# EAGLE design Extern_Kernal_REX9628 (EAGLE 9.2.2)
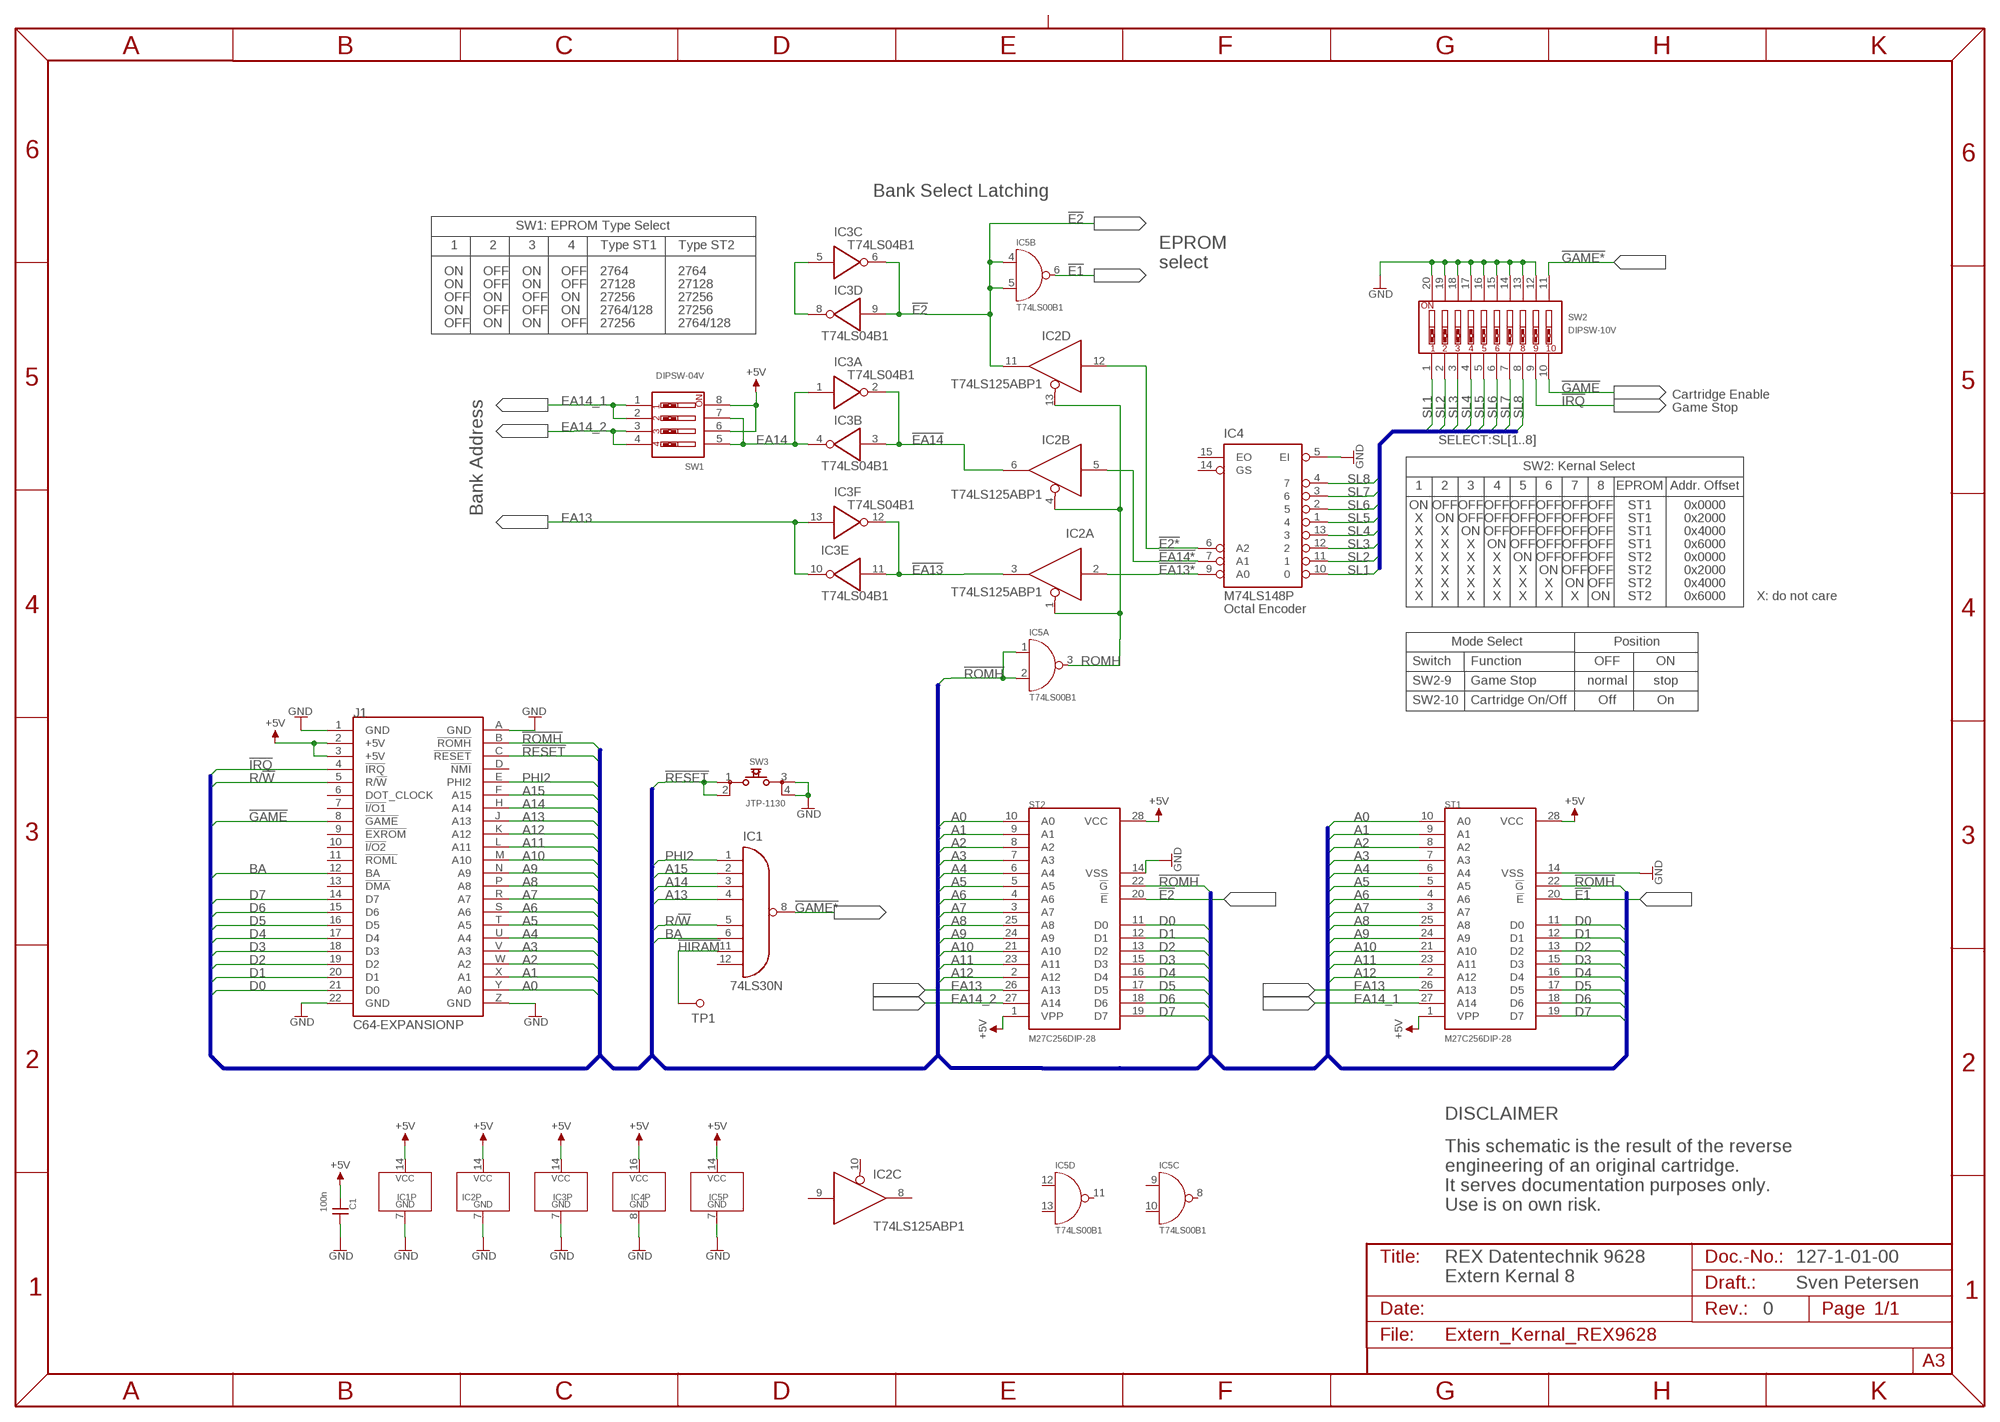
[diagram p0: schematic, sheet 1]

## Parts
C1  100n  CAP01  [C-2,5]
IC1  74LS30N  7430DIP  [DIL-14]
IC2  T74LS125ABP1  74125DIP  [DIL-14]
IC3  T74LS04B1  7404DIL  [DIL-14]
IC4  M74LS148P  74148DIL  [DIL-16]
IC5  T74LS00B1  7400DIP  [DIL-14]
J1  C64-EXPANSIONP  [EXPPORT]
ST1  M27C256DIP-28  [DIL28-6]
ST2  M27C256DIP-28  [DIL28-6]
SW1  DIPSW-04V  [DIPSW-04V]
SW2  DIPSW-10V  [DIPSW-10V]
SW3  JTP-1130  [JTP-1130]
TP1  1,3/2,0  [1,3/2,0]

## Nets
!E1: IC5.6(B:O) ST1.20(!E)
!E2: IC2.11(D:O) IC3.6(C:O) IC3.9(D:I) IC5.4(B:I0) IC5.5(B:I1) ST2.20(!E)
!E2*: IC2.12(D:I) IC4.6(A2)
!EA13: IC2.3(A:O) IC3.11(E:I) IC3.12(F:O)
!EA13*: IC2.2(A:I) IC4.9(A0)
!EA14: IC2.6(B:O) IC3.2(A:O) IC3.3(B:I)
!EA14*: IC2.5(B:I) IC4.7(A1)
!GAME: J1.8(!GAME) SW2.10
!GAME*: IC1.8(O) SW2.11
!HIRAM: IC1.11(I6) TP1.1
!IRQ: J1.4(!IRQ) SW2.9
!RESET: J1.C(!RESET) SW3.1 SW3.2
!ROMH: IC5.1(A:I0) IC5.2(A:I1) J1.B(!ROMH) ST1.22(!G) ST2.22(!G)
+5V: C1.1 IC1.14(VCC) IC2.14(P:VCC) IC3.14(P:VCC) IC4.16(VCC) IC5.14(P:VCC) J1.2(+5V) J1.3(+5V) ST1.1(VPP) ST1.28(VCC) ST2.1(VPP) ST2.28(VCC) SW1.6 SW1.8
A0: J1.Y(A0) ST1.10(A0) ST2.10(A0)
A1: J1.X(A1) ST1.9(A1) ST2.9(A1)
A2: J1.W(A2) ST1.8(A2) ST2.8(A2)
A3: J1.V(A3) ST1.7(A3) ST2.7(A3)
A4: J1.U(A4) ST1.6(A4) ST2.6(A4)
A5: J1.T(A5) ST1.5(A5) ST2.5(A5)
A6: J1.S(A6) ST1.4(A6) ST2.4(A6)
A7: J1.R(A7) ST1.3(A7) ST2.3(A7)
A8: J1.P(A8) ST1.25(A8) ST2.25(A8)
A9: J1.N(A9) ST1.24(A9) ST2.24(A9)
A10: J1.M(A10) ST1.21(A10) ST2.21(A10)
A11: J1.L(A11) ST1.23(A11) ST2.23(A11)
A12: J1.K(A12) ST1.2(A12) ST2.2(A12)
A13: IC1.4(I3) J1.J(A13)
A14: IC1.3(I2) J1.H(A14)
A15: IC1.2(I1) J1.F(A15)
BA: IC1.6(I5) J1.12(BA)
D0: J1.21(D0) ST1.11(D0) ST2.11(D0)
D1: J1.20(D1) ST1.12(D1) ST2.12(D1)
D2: J1.19(D2) ST1.13(D2) ST2.13(D2)
D3: J1.18(D3) ST1.15(D3) ST2.15(D3)
D4: J1.17(D4) ST1.16(D4) ST2.16(D4)
D5: J1.16(D5) ST1.17(D5) ST2.17(D5)
D6: J1.15(D6) ST1.18(D6) ST2.18(D6)
D7: J1.14(D7) ST1.19(D7) ST2.19(D7)
EA13: IC3.10(E:O) IC3.13(F:I) ST1.26(A13) ST2.26(A13)
EA14: IC3.1(A:I) IC3.4(B:O) SW1.5 SW1.7
EA14_1: ST1.27(A14) SW1.1 SW1.2
EA14_2: ST2.27(A14) SW1.3 SW1.4
GND: C1.2 IC1.7(GND) IC2.7(P:GND) IC3.7(P:GND) IC4.5(EI) IC4.8(GND) IC5.7(P:GND) J1.1(GND) J1.22(GND) J1.A(GND) J1.Z(GND) ST1.14(VSS) ST2.14(VSS) SW2.12 SW2.13 SW2.14 SW2.15 SW2.16 SW2.17 SW2.18 SW2.19 SW2.20 SW3.3 SW3.4
N$3: IC3.5(C:I) IC3.8(D:O)
PHI2: IC1.1(I0) J1.E(PHI2)
R/!W: IC1.5(I4) J1.5(R/!W)
ROMH: IC2.1(A:OE) IC2.4(B:OE) IC2.13(D:OE) IC5.3(A:O)
SL1: IC4.10 SW2.1
SL2: IC4.11 SW2.2
SL3: IC4.12 SW2.3
SL4: IC4.13 SW2.4
SL5: IC4.1 SW2.5
SL6: IC4.2 SW2.6
SL7: IC4.3 SW2.7
SL8: IC4.4 SW2.8
Unconnected: IC1.12(I7) IC2.8(C:O) IC2.9(C:I) IC2.10(C:OE) IC4.14(GS) IC4.15(EO) IC5.8(C:O) IC5.9(C:I0) IC5.10(C:I1) IC5.11(D:O) IC5.12(D:I0) IC5.13(D:I1) J1.6(DOT_CLOCK) J1.7(!I/O1) J1.9(!EXROM) J1.10(!I/O2) J1.11(!ROML) J1.13(!DMA) J1.D(!NMI)

## Buses
EXPANSION:A0,A1,A2,A3,A4,A5,A6,A7,A8,A9,A10,A11,A12,A13,A14,A15,BA,D0,D1,D2,D3,D4,D5,D6,D7,!DMA,DOT_CLK,!EXROM,!GAME,!I/O1,!I/O2,!IRQ,!NMI,PHI2,!RESET,!ROMH,!ROML,R/!W
SELECT:SL[1..8]

## Notes on the sheet
- Bank Select Latching
- SW1: EPROM Type Select
- 1 | 2 | 3 | 4 | Type ST1 | Type ST2
- EPROM
  select
- ON | OFF | ON | OFF | 2764 | 2764
- ON | OFF | ON | OFF | 27128 | 27128
- OFF | ON | OFF | ON | 27256 | 27256
- ON | OFF | OFF | ON | 2764/128 | 27256
- OFF | ON | ON | OFF | 27256 | 2764/128
- Cartridge Enable
- Game Stop
- SW2: Kernal Select
- 1 | 2 | 3 | 4 | 5 | 6 | 7 | 8 | EPROM | Addr. Offset
- ON | OFF | OFF | OFF | OFF | OFF | OFF | OFF | ST1 | 0x0000
- Bank Address
- X | ON | OFF | OFF | OFF | OFF | OFF | OFF | ST1 | 0x2000
- X | X | ON | OFF | OFF | OFF | OFF | OFF | ST1 | 0x4000
- X | X | X | ON | OFF | OFF | OFF | OFF | ST1 | 0x6000
- X | X | X | X | ON | OFF | OFF | OFF | ST2 | 0x0000
- X | X | X | X | X | ON | OFF | OFF | ST2 | 0x2000
- X | X | X | X | X | X | ON | OFF | ST2 | 0x4000
- X | X | X | X | X | X | X | ON | ST2 | 0x6000 | X: do not care
- Octal Encoder
- Mode Select | Position
- Switch | Function | OFF | ON
- SW2-9 | Game Stop | normal | stop
- SW2-10 | Cartridge On/Off | Off | On
- DISCLAIMER
- This schematic is the result of the reverse
  engineering of an original cartridge.
  It serves documentation purposes only.
  Use is on own risk.
- REX Datentechnik 9628 | 127-1-01-00
- Extern Kernal 8
- Sven Petersen
- 0

## Library data of the parts
C1 = DISCRETE:CAP01
IC1 = 74XX:7430
IC2 = 74XX:74125
IC3 = 74XX:7404
IC4 = 74XX:74148
IC5 = 74XX:7400: Quad 2-input NAND Gate SO14
J1 = Commodore:C64-EXPANSIONP
ST1 ST2 = ST:M27C256
SW1 = DIPSWITCH:DIPSW-04
SW2 = DIPSWITCH:DIPSW-10
SW3 = Namae_Electronics:JTP-1130
TP1 = Pads:1,3/2,0: Testpunkt Typ: 13.70.635 Hersteller: Ettinger Technologie: Einpresstechnik Bauform: - erzeugt von: C. Zellner am: 13.3.2015 letzte Änderung: - Eagle-Version: 6.5.0

## Board
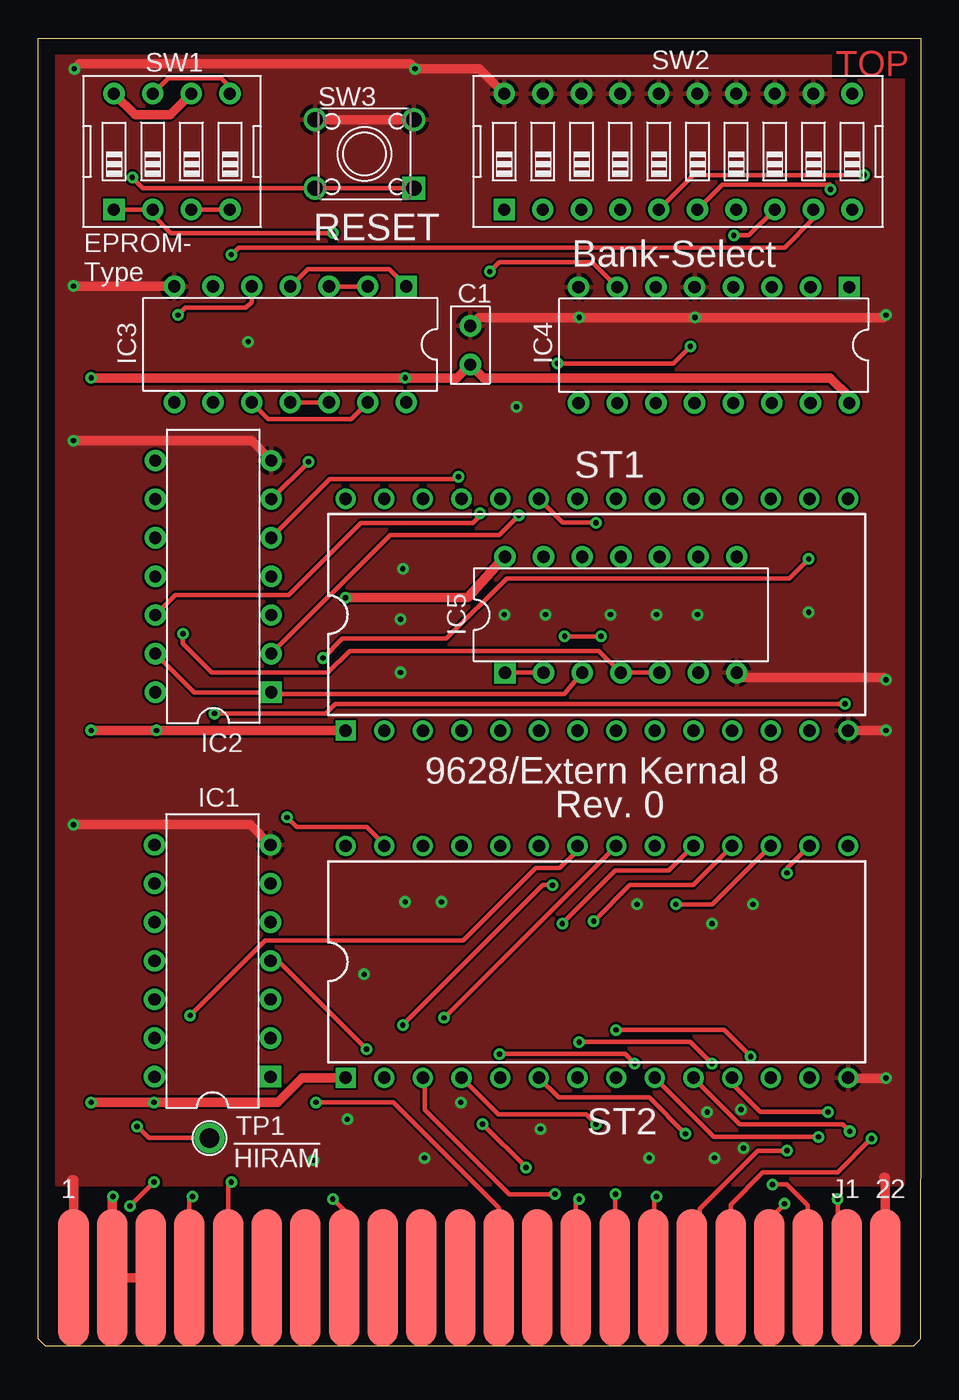
[diagram p1: board, top side]
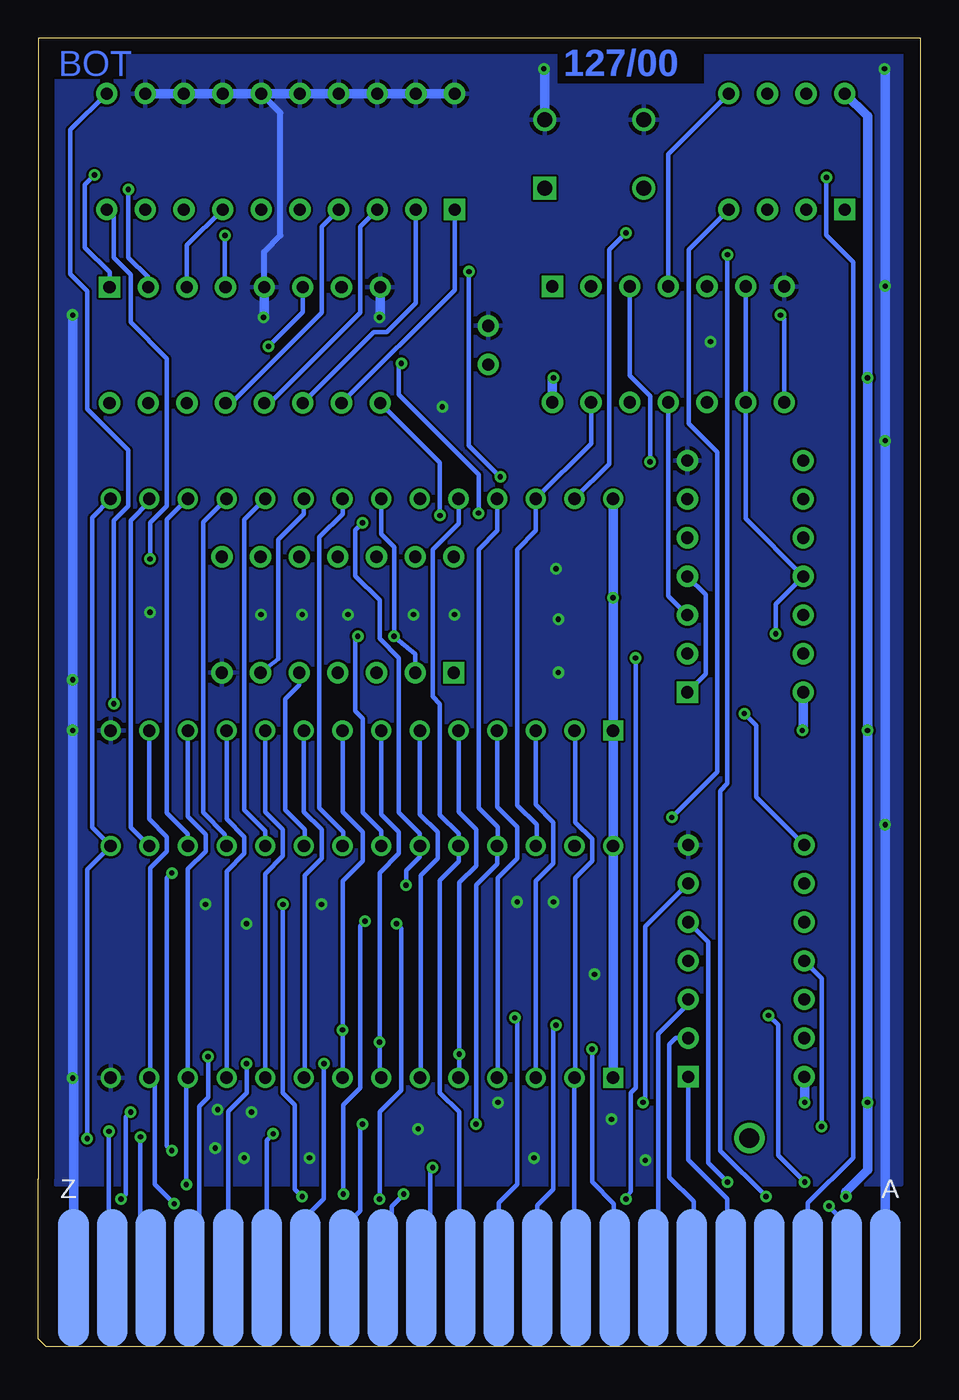
[diagram p2: board, bottom side, seen from below]

Size 58 x 86 mm. Coordinates in mm from the lower left corner, seen from the top.
Outline: 0,11 0,86 58,86 58,11
Copper layers (1*16): Top 0.035mm / dielectric 1.5mm / Bottom 0.035mm
Design rules "default *": minimum track width 6mil, minimum drill 0.35mm, track to track 6mil, track to pad 6mil, pad to pad 6mil, via to via 6mil, smd to smd 6mil, copper to edge 40mil, drill to drill 6mil, minimum pad ring 10mil, minimum via ring 8mil, stop-mask expansion 4mil, vias tented up to drill 25mil, thermal gap 10mil
bRestrict: 4 lines

### Footprints (pad centres in the part's own frame; a part is rotated, then mirrored left to right if it is on the bottom)
C-2,5 = drill 0.8 pad 1.397: 1 -1.27,0; 2 1.27,0
DIL-14 = drill 0.8 pad 1.397 square: 1 -7.62,-3.81 | drill 0.8 pad 1.397: 2 -5.08,-3.81; 3 -2.54,-3.81; 4 0,-3.81; 5 2.54,-3.81; 6 5.08,-3.81; 7 7.62,-3.81; 8 7.62,3.81; 9 5.08,3.81; 10 2.54,3.81; 11 0,3.81; 12 -2.54,3.81; 13 -5.08,3.81; 14 -7.62,3.81
DIL-16 = drill 0.8 pad 1.397 square: 1 -8.89,-3.81 | drill 0.8 pad 1.397: 2 -6.35,-3.81; 3 -3.81,-3.81; 4 -1.27,-3.81; 5 1.27,-3.81; 6 3.81,-3.81; 7 6.35,-3.81; 8 8.89,-3.81; 9 8.89,3.81; 10 6.35,3.81; 11 3.81,3.81; 12 1.27,3.81; 13 -1.27,3.81; 14 -3.81,3.81; 15 -6.35,3.81; 16 -8.89,3.81
EXPPORT = smd 2 x 9: 1 26.67,-4.5; 2 24.13,-4.5; 3 21.59,-4.5; 4 19.05,-4.5; 5 16.51,-4.5; 6 13.97,-4.5; 7 11.43,-4.5; 8 8.89,-4.5; 9 6.35,-4.5; 10 3.81,-4.5; 11 1.27,-4.5; 12 -1.27,-4.5; 13 -3.81,-4.5; 14 -6.35,-4.5; 15 -8.89,-4.5; 16 -11.43,-4.5; 17 -13.97,-4.5; 18 -16.51,-4.5; 19 -19.05,-4.5; 20 -21.59,-4.5; 21 -24.13,-4.5; 22 -26.67,-4.5 | smd 2 x 9 bottom: A 26.67,-4.5; B 24.13,-4.5; C 21.59,-4.5; D 19.05,-4.5; E 16.51,-4.5; F 13.97,-4.5; H 11.43,-4.5; J 8.89,-4.5; K 6.35,-4.5; L 3.81,-4.5; M 1.27,-4.5; N -1.27,-4.5; P -3.81,-4.5; R -6.35,-4.5; S -8.89,-4.5; T -11.43,-4.5; U -13.97,-4.5; V -16.51,-4.5; W -19.05,-4.5; X -21.59,-4.5; Y -24.13,-4.5; Z -26.67,-4.5
DIL28-6 = drill 0.813 square: 1 -16.51,-7.62 | drill 0.813: 2 -13.97,-7.62; 3 -11.43,-7.62; 4 -8.89,-7.62; 5 -6.35,-7.62; 6 -3.81,-7.62; 7 -1.27,-7.62; 8 1.27,-7.62; 9 3.81,-7.62; 10 6.35,-7.62; 11 8.89,-7.62; 12 11.43,-7.62; 13 13.97,-7.62; 14 16.51,-7.62; 15 16.51,7.62; 16 13.97,7.62; 17 11.43,7.62; 18 8.89,7.62; 19 6.35,7.62; 20 3.81,7.62; 21 1.27,7.62; 22 -1.27,7.62; 23 -3.81,7.62; 24 -6.35,7.62; 25 -8.89,7.62; 26 -11.43,7.62; 27 -13.97,7.62; 28 -16.51,7.62
DIPSW-04V = drill 0.787 pad 1.397 square: 1 -3.81,-3.81 | drill 0.787 pad 1.397: 2 -1.27,-3.81; 3 1.27,-3.81; 4 3.81,-3.81; 5 3.81,3.81; 6 1.27,3.81; 7 -1.27,3.81; 8 -3.81,3.81
DIPSW-10V = drill 0.787 pad 1.397 square: 1 -11.43,-3.81 | drill 0.787 pad 1.397: 2 -8.89,-3.81; 3 -6.35,-3.81; 4 -3.81,-3.81; 5 -1.27,-3.81; 6 1.27,-3.81; 7 3.81,-3.81; 8 6.35,-3.81; 9 8.89,-3.81; 10 11.43,-3.81; 11 11.43,3.81; 12 8.89,3.81; 13 6.35,3.81; 14 3.81,3.81; 15 1.27,3.81; 16 -1.27,3.81; 17 -3.81,3.81; 18 -6.35,3.81; 19 -8.89,3.81; 20 -11.43,3.81
JTP-1130 = drill 1 square: 1 3.25,-2.25 | drill 1: 2 -3.25,-2.25; 3 3.25,2.25; 4 -3.25,2.25
1,3/2,0 = drill 1.3 pad 2: 1 0,0

### Placement (x,y rotation side)
C1  28.41,65.81 90 top
IC1  11.46,25.34 90 top
IC2  11.52,50.61 90 top
IC3  16.58,65.86 180 top
IC4  44.41,65.82 180 top
IC5  38.3,48.09 0 top
J1  29,0 180 top
ST1  36.72,48.09 0 top
ST2  36.72,25.27 0 top
SW1  8.8,78.54 0 top
SW2  42.06,78.54 0 top
SW3  21.45,78.38 0 top
TP1  11.26,13.69 0 top
U$44  [2LAYER]  52.39,83.5 0 top
U$45  [PCB-TITLE/]  0,93.98 0 top  (outside the outline)

### Tracks (layer width: path | path; a pad name or v marks a point on that pad's centre or on a via)
!E1
  Bottom 0.305: ST1.20 40.53,54.72 42.23,53.02 42.23,45.18 IC5.6
!E2  (via drill 0.35)
  Top 0.305: IC5.5 IC5.4 36.86,45.72 20.48,45.72 19.05,44.29 11.43,44.29 9.53,46.2 v9.53,46.83
  Bottom 0.305: IC5.5 40.84,43.46 41.75,42.55 41.75,35.24 40.48,33.97 40.48,32.94 ST2.20 | v9.53,46.83 9.53,48.8 IC2.11 11.5,54.4 IC3.9 IC3.6
!E2*  (via drill 0.35)
  Top 0.305: IC2.12 9.01,49.37 16.46,49.37 21.2,54.12 28.56,54.12 29.05,54.61 v29.05,54.77 | v34.13,64.61 41.75,64.61 v42.86,65.72
  Bottom 0.305: v34.13,64.61 34.29,64.45 34.29,62.55 29.05,57.31 v29.05,54.77 | v42.86,65.72 40.6,67.98 IC4.6
!EA13
  Top 0.305: IC3.11 IC3.12
  Bottom 0.305: IC2.3 16.58,49.32 IC3.11
!EA13*  (via drill 0.35)
  Top 0.305: IC2.2 23.14,53.34 30.32,53.34 v31.59,54.61
  Bottom 0.305: v31.59,54.61 31.59,58.08 IC4.9
!EA14  (via drill 0.35)
  Top 0.305: IC3.3 IC3.2 | v17.78,58.14 IC2.6
  Bottom 0.305: IC3.3 19.12,63.8 17.78,62.46 v17.78,58.14
!EA14*  (via drill 0.35)
  Top 0.305: IC2.5 19.17,56.99 27.3,56.99 27.46,57.15 v27.62,57.15 | v29.69,70.64 30.32,71.28 36.41,71.28 IC4.7
  Bottom 0.305: v27.62,57.15 29.69,59.21 v29.69,70.64
!GAME  (via drill 0.35)
  Top 0.305: v50.64,51.75 49.37,50.48 30.8,50.48 26.83,46.51 20,46.51 v18.73,45.24 | v19.37,9.68 20.48,8.57 20.48,4.29 20.32,4.13 20.32,4.29 J1.8
  Bottom 0.305: SW2.10 53.02,74.26 53.02,71.56 51.91,70.45 51.91,67.31 49.53,64.93 49.53,55.24 50.64,54.13 v50.64,51.75 | v18.73,45.24 18.73,41.27 18.73,16.99 19.05,16.67 19.05,10.2 v19.37,9.68
!GAME*  (via drill 0.35)
  Top 0.305: v53.02,42.23 19.53,42.23 18.89,41.59 12.06,41.59 v11.59,41.59
  Bottom 0.305: SW2.11 55.88,79.96 55.88,70.48 54.77,69.37 54.77,61.59 52.07,58.9 52.07,55.24 53.02,54.29 v53.02,42.23 | v11.59,41.59 10.79,40.8 10.79,36.1 IC1.8
!HIRAM  (via drill 0.35)
  Top 0.305: v6.51,14.45 7.26,13.69 TP1.1
  Bottom 0.305: IC1.11 6.51,24.2 v6.51,14.45
!IRQ  (via drill 0.35)
  Top 0.305: J1.4 9.95,9.63 v10.16,9.84 | v12.7,71.75 13.18,72.23 49.05,72.23 50.95,74.13 SW2.9
  Bottom 0.305: v10.16,9.84 13.18,12.86 13.18,36.51 12.7,36.99 v12.7,71.75
!RESET  (via drill 0.35)
  Top 0.305: SW3.1 SW3.2 6.9,76.13 v6.19,76.83
  Bottom 0.305: v6.19,76.83 6.19,73.03 4.45,71.28 4.45,12.38 7.41,9.42 J1.C
!ROMH  (via drill 0.35)
  Top 0.305: v36.99,46.67 v34.61,46.67 | IC5.2 IC5.1 | v6.03,9.21 v7.62,10.79 | v10,21.75 14.92,26.67 27.94,26.67 32.7,31.43 34.29,31.43 35.45,32.59 ST2.22
  Bottom 0.305: ST1.22 35.45,53.39 34.61,52.55 v34.61,46.67 34.62,46.67 33.22,45.52 IC5.2 | v36.99,46.67 37.15,46.51 37.15,41.75 36.67,41.27 36.67,35.08 35.45,33.86 ST2.22 | J1.B 4.87,8.04 v6.03,9.21 | v7.62,10.79 9.37,12.54 9.37,21.11 v10,21.75
+5V  (via drill 0.35)
  Top 0.61: v4.92,9.84 4.87,9.79 J1.2 J1.3 | v3.49,40.48 v7.78,40.48 20.2,40.48 ST1.1 | ST2.1 17.35,17.65 15.74,16.03 v7.62,16.03 v3.49,16.03 | IC5.14 28.24,49.21 v20.21,49.21 | v3.49,63.66 v24.13,63.66 27.53,63.66 C1.1 29.29,63.66 52.07,63.66 53.3,62.43 IC4.16 | SW1.8 6.38,80.96 8.68,80.96 SW1.6
  Bottom 0.61: v4.92,9.84 4.92,10.16 3.49,11.59 v3.49,16.03 v3.49,40.48 v3.49,63.66 3.49,80.85 SW1.8 | IC2.14 7.71,40.55 v7.78,40.48 | v7.62,16.03 7.62,17.69 IC1.14 | ST2.1 ST2.28 ST1.1 v20.21,49.21 ST1.28 | v24.13,63.66 24.2,63.59 IC3.14
A0  (via drill 0.35)
  Top 0.305: ST2.10 46.12,14.61 52.86,14.61 v53.34,14.13
  Bottom 0.305: ST1.10 43.07,35.13 41.91,33.97 41.91,32.23 43.07,31.07 ST2.10 | J1.Y 53.34,4.71 v53.34,14.13
A1  (via drill 0.35)
  Top 0.305: ST2.9 44.42,13.76 v51.28,13.76
  Bottom 0.305: ST1.9 40.53,35.13 39.37,33.97 39.37,32.07 40.48,30.96 40.48,17.7 ST2.9 | v51.28,13.76 51.28,13.13 51.28,5.19 J1.X
A2  (via drill 0.35)
  Top 0.305: v46.83,19.05 45.09,20.8 v37.99,20.8 | v37.99,20.8 37.94,20.8 v37.99,20.8
  Bottom 0.305: ST1.8 37.99,35.13 36.67,33.81 36.67,31.91 37.99,30.59 v37.99,20.8 ST2.8 | J1.W 47.41,5.13 47.41,15.77 46.83,16.35 v46.83,19.05
A3  (via drill 0.35)
  Top 0.305: v44.29,18.57 42.86,20 v35.56,20
  Bottom 0.305: ST1.7 35.45,34.97 34.29,33.81 34.29,32.38 35.56,31.11 v35.56,20 35.56,17.76 ST2.7 | v44.29,18.57 44.29,16.67 45.51,15.45 J1.V
A4  (via drill 0.35)
  Top 0.305: ST2.6 34.21,16.35 40.16,16.35 v42.55,13.97
  Bottom 0.305: ST1.6 32.91,34.97 31.75,33.81 31.75,32.07 32.86,30.96 32.86,19.68 32.86,17.7 ST2.6 | v42.55,13.97 42.97,13.54 J1.U
A5  (via drill 0.35)
  Top 0.305: v39.21,18.57 38.58,19.21 v30.32,19.21
  Bottom 0.305: ST1.5 30.37,35.13 29.21,33.97 29.21,31.59 30.32,30.48 v30.32,19.21 30.32,17.7 ST2.5 | J1.T 40.43,8.46 39.21,9.68 v39.21,18.57
A6  (via drill 0.35)
  Top 0.305: ST2.4 30.24,15.24 36.04,15.24 v36.67,14.61
  Bottom 0.305: ST1.4 27.83,35.45 26.51,34.13 26.51,32.07 27.78,30.8 27.78,17.7 ST2.4 | J1.S 37.89,7.83 36.83,8.89 36.83,13.49 36.83,13.81 36.83,14.45 v36.67,14.61
A7  (via drill 0.35)
  Top 0.305: v33.97,10 30.96,10 25.4,15.56 25.4,17.54 ST2.3
  Bottom 0.305: ST1.3 25.29,35.61 24.13,34.45 24.13,31.75 25.29,30.59 ST2.3 | v33.97,10 34.77,9.21 34.77,5.08 J1.R
A8  (via drill 0.35)
  Top 0.305: v32.07,11.75 v29.21,14.61
  Bottom 0.305: ST1.25 27.83,53.61 29.05,52.39 29.05,35.4 27.78,34.13 27.78,32.94 ST2.25 27.83,31.7 29.21,30.32 v29.21,14.61 | v32.07,11.75 32.23,11.59 32.23,5.08 J1.P
A9
  Bottom 0.305: ST2.24 30.37,33.02 | 30.37,33.02 30.37,33.7 31.59,34.92 31.59,42.23 32.07,42.7 32.07,52.39 30.37,54.09 ST1.24 | J1.N 30.32,4.55 30.32,15.4 31.59,16.67 31.59,30.64 30.37,31.86 30.37,33.02
A10  (via drill 0.35)
  Top 0.305: v26.67,21.59 26.69,21.59 ST2.21
  Bottom 0.305: ST1.21 37.99,54.72 39.53,53.18 39.53,35.4 37.94,33.81 37.94,32.94 ST2.21 | J1.M 27.73,9.42 26.51,10.64 26.51,21.43 v26.67,21.59
A11  (via drill 0.35)
  Top 0.305: v36.67,54.13 34.49,54.13 ST1.23 | v23.97,21.11 28.42,25.56 33.18,30.32 v33.81,30.32
  Bottom 0.305: v36.67,54.13 37.15,53.66 37.15,50.64 35.56,49.05 35.56,46.52 34.29,45.25 34.29,35.08 32.91,33.7 ST2.23 32.91,32.18 33.81,31.27 v33.81,30.32 | J1.L 25.19,9.26 24.13,10.32 24.13,20.95 v23.97,21.11
A12
  Bottom 0.305: ST1.2 22.7,40.42 22.7,34.45 21.59,33.34 21.59,31.91 22.7,30.8 22.7,17.7 ST2.2 22.75,4.6 J1.K
A13  (via drill 0.35)
  Top 0.305: IC1.4 15.78,25.34 v21.59,19.53
  Bottom 0.305: J1.J 20.16,4.55 20.16,9.37 21.59,10.79 v21.59,19.53
A14
  Bottom 0.305: J1.H 17.57,8.31 17.25,8.63 17.25,20.53 15.27,22.51 IC1.3
A15
  Bottom 0.305: IC1.2 16.09,20.26 16.51,19.84 16.51,11.11 14.92,9.53 14.92,4.61 J1.F
BA  (via drill 0.35)
  Top 0.305: v18.26,16.03 23.34,16.03 30.27,9.1 J1.12
  Bottom 0.305: IC1.6 18.1,27.59 18.1,16.19 v18.26,16.03
D0  (via drill 0.35)
  Top 0.305: v52.55,9.68 52.55,5.08 J1.21 | v51.91,15.4 47.47,15.4 45.61,17.25 ST2.11
  Bottom 0.305: ST1.11 45.61,34.66 44.45,33.5 44.45,32.38 45.61,31.23 ST2.11 | v52.55,9.68 52.23,10 52.23,15.08 v51.91,15.4
D1  (via drill 0.35)
  Top 0.305: J1.20 50.59,9.26 49.21,10.64 v48.26,10.64
  Bottom 0.305: ST1.12 48.15,34.81 46.99,33.66 46.99,32.54 48.15,31.38 ST2.12 48.26,17.54 v48.26,10.64
D2  (via drill 0.35)
  Top 0.305: J1.19 48.05,8.36 v49.05,9.37
  Bottom 0.305: ST1.13 50.69,34.66 49.53,33.5 49.53,32.54 50.64,31.43 50.64,17.7 | 50.64,17.7 ST2.13 | v49.05,9.37 50.32,10.64 50.32,17.38 50.64,17.7
D3  (via drill 0.35)
  Top 0.305: J1.18 45.51,9.31 47.62,11.43 52.55,11.43 v54.77,13.65
  Bottom 0.305: ST1.15 54.45,54.49 54.45,34.11 ST2.15 54.77,31.35 v54.77,13.65
D4  (via drill 0.35)
  Top 0.305: J1.17 43.5,5.03 43.5,9.05 47.31,12.86 v49.21,12.86 | v49.21,31.11 49.21,31.41 ST2.16
  Bottom 0.305: ST2.16 51.91,34.11 51.91,54.29 50.69,55.51 ST1.16 | v49.21,12.86 49.53,13.18 49.53,30.8 v49.21,31.11
D5  (via drill 0.35)
  Top 0.305: J1.16 40.48,4.45 40.48,3.81 40.48,9.68 v40.64,9.84 | v41.91,29.05 44.31,29.05 ST2.17
  Bottom 0.305: ST2.17 48.15,33.68 49.53,35.06 49.53,54.33 ST1.17 | v40.64,9.84 41.12,10.32 41.12,15.88 41.91,16.67 v41.91,29.05
D6  (via drill 0.35)
  Top 0.305: J1.15 37.94,4.55 v37.94,10 | v36.51,27.94 38.89,30.32 43.04,30.32 ST2.18
  Bottom 0.305: ST1.18 47.15,54.17 47.15,35.08 45.72,33.66 45.72,33 ST2.18 | v37.94,10 37.94,15.88 36.83,16.99 36.83,27.62 v36.51,27.94
D7  (via drill 0.35)
  Top 0.305: J1.14 35.35,9.47 v35.56,9.68 | v34.45,27.78 37.94,31.27 41.45,31.27 ST2.19
  Bottom 0.305: ST2.19 43.07,33.86 44.45,35.24 44.45,54.33 ST1.19 | v35.56,9.68 35.56,15.4 34.13,16.83 34.13,27.46 v34.45,27.78
EA13
  Top 0.305: IC3.10 15.13,60.96 20.57,60.96 IC3.13
  Bottom 0.305: ST2.26 25.24,32.94 25.24,34.29 26.51,35.56 26.51,52.39 25.29,53.61 ST1.26 21.66,59.34 IC3.13
EA14
  Top 0.305: IC3.1 23.07,70.8 17.71,70.8 IC3.4 | SW1.7 8.55,83.37 12.04,83.37 12.61,82.8 SW1.5
  Bottom 0.305: SW1.5 16.58,78.38 IC3.4
EA14_1  (via drill 0.35)
  Top 0.305: SW1.1 SW1.2 7.53,74.39 8.73,73.18 v19.37,73.18
  Bottom 0.305: ST1.27 20.48,57.98 20.48,72.07 v19.37,73.18
EA14_2  (via drill 0.35)
  Top 0.305: SW1.3 SW1.4 | v16.35,34.77 16.99,34.13 21.59,34.13 22.38,33.34 22.38,33.26 ST2.27
  Bottom 0.305: SW1.4 15.24,72.1 15.24,60.67 13.35,58.78 13.35,37.76 v16.35,34.77
GND  (via drill 0.35)
  Top 0.61: v2.38,83.98 2.7,84.3 24.45,84.3 v24.77,83.98 29,83.98 SW2.20 | SW3.4 SW3.3 | IC2.7 14.03,59.53 v2.33,59.53 | v2.33,69.69 8.94,69.69 IC3.7 | IC1.7 13.94,34.29 v2.33,34.29 | v55.72,17.62 53.26,17.62 ST2.14 | IC5.7 45.98,43.97 55.56,43.97 v55.72,43.81 | v55.72,40.48 53.24,40.48 ST1.14 | C1.2 28.96,67.63 v35.56,67.63 v43.18,67.63 55.56,67.63 v55.72,67.79 | J1.A 2.33,10.95 2.22,10.95 | J1.Z 55.67,11.11 55.56,11.11
  Bottom 0.406: IC4.5 43.14,71.95 42.07,73.03 42.07,81.09 SW2.15
  Bottom 0.61: J1.A v2.33,34.29 v2.33,59.53 v2.33,69.69 2.33,83.93 v2.38,83.98 | SW3.3 24.7,83.91 v24.77,83.98 | J1.Z 55.67,17.57 v55.72,17.62 v55.72,40.48 v55.72,43.81 v55.72,67.79 | SW2.20 SW2.19 SW2.18 SW2.17 SW2.16 SW2.15 SW2.14 SW2.13 SW2.12 | v35.56,67.63 35.52,67.67 IC4.8 | v43.18,67.63 43.14,67.67 IC4.5
  other vias: 23.97,51.12 23.81,47.78 23.81,44.29 21.43,24.45 24.13,29.21 26.51,29.21 39.37,29.05 44.29,27.78 46.99,29.05 33.02,14.29 27.78,16.03 20.32,14.92 44.45,12.38 46.35,13.02 43.97,15.4 46.2,15.56 40.16,12.38 25.4,12.38 18.1,12.22 31.43,61.75 30.64,48.1 33.34,48.1 37.62,48.1 40.64,48.1 43.34,48.1 50.64,48.26 13.81,66.04
  pour Top: 1.27,85.09 56.83,85.09 56.83,10.64 1.27,10.64
  pour Bottom: 1.27,85.09 56.83,85.09 56.83,10.64 1.27,10.64
N$3  (via drill 0.35)
  Top 0.305: v9.21,67.79 9.68,68.26 13.65,68.26 14.04,68.65 IC3.5
  Bottom 0.305: IC3.8 8.96,67.54 v9.21,67.79
PHI2
  Bottom 0.305: IC1.1 15.27,12.25 12.7,9.68 12.7,4.71 J1.E
R/!W  (via drill 0.35)
  Top 0.305: J1.5 12.49,10.59 v12.7,10.79
  Bottom 0.305: v12.7,10.79 13.97,12.06 13.97,26.58 IC1.5
ROMH
  Top 0.305: IC5.3 34.59,42.86 15.46,42.86 IC2.1 10.25,42.99 IC2.13
  Bottom 0.305: IC2.1 14.13,44.19 14.13,49.41 IC2.4
SL1
  Bottom 0.305: IC4.10 30.63,69.44 SW2.1
SL2
  Bottom 0.305: IC4.11 35.94,66.67 35.08,66.67 33.17,68.59 SW2.2
SL3
  Bottom 0.305: SW2.3 36.83,73.61 36.83,67.94 42.77,62.01 IC4.12
SL4
  Bottom 0.305: SW2.4 39.37,73.61 39.37,67.94 45.3,62.01 IC4.13
SL5  (via drill 0.35)
  Top 0.305: SW2.5 43.05,76.99 v54.29,76.99
  Bottom 0.305: v54.29,76.99 54.93,76.36 54.93,72.23 53.3,70.6 IC4.1
SL6  (via drill 0.35)
  Top 0.305: SW2.6 44.96,76.36 52.07,76.36 v52.07,76.04
  Bottom 0.305: v52.07,76.04 52.07,71.58 50.76,70.27 IC4.2
SL7
  Bottom 0.305: SW2.7 48.22,72.38 IC4.3
SL8  (via drill 0.35)
  Top 0.305: SW2.8 46.7,73.03 v45.72,73.03
  Bottom 0.305: v45.72,73.03 45.72,69.67 IC4.4

### Text on the board
Bottom: 127/00
tPlace: RESET | Bank-Select | EPROM- / Type | 9628/Extern Kernal 8 | Rev. 0 | !HIRAM
Document: Sven Petersen | 127-2-01-00 | 2019 | 35µm | 2 | 0